# Altium schematic sheet InertiaScreen_CurriculumDesign.SchDoc
size 177 x 152 mm; SheetNumber: 1; SheetTotal: 1
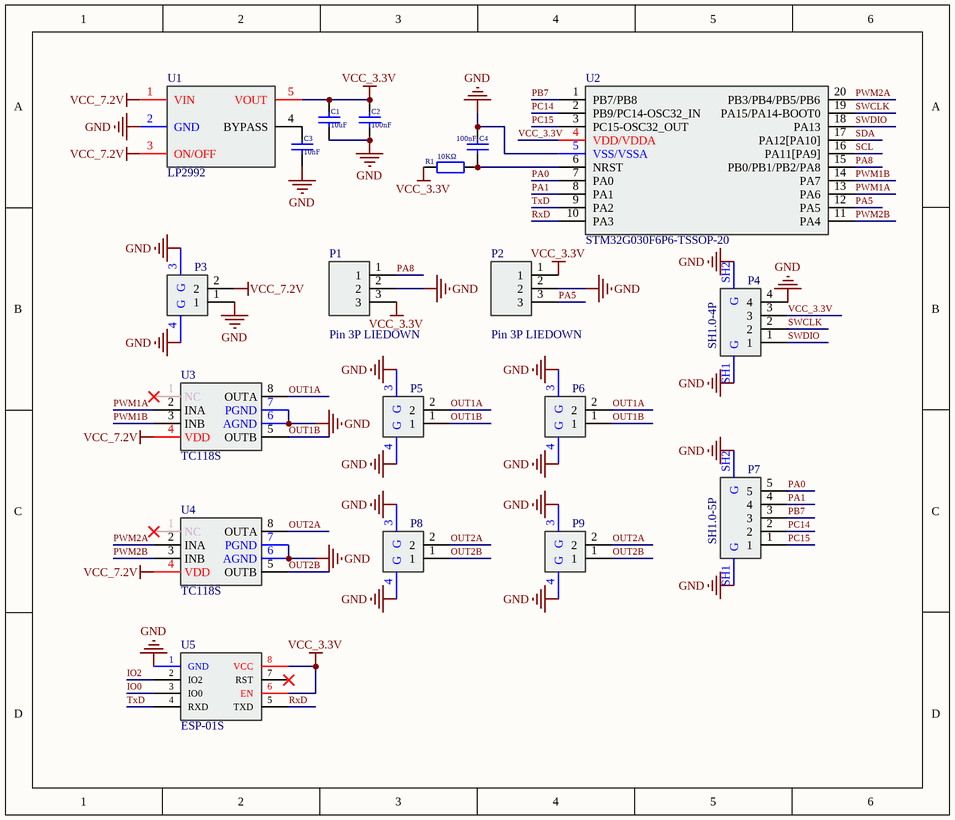
[diagram p0: InertiaScreen_CurriculumDesign.SchDoc]

## Parts
C1  10uF  [0402_C]
C2  100nF  [0402_C]
C3  10nF  [0402_C]
C4  100nF  [0402_C]
P1  Pin 3P LIEDOWN  [Pin 3P LieDown]
P2  Pin 3P LIEDOWN  [Pin 3P LieDown]
P3  SH1.00mm 2P  [SH1.0-2P]  (value not drawn)
P4  SH1.0-4P  [SH1.0-4P]
P5  SH1.00mm 2P  [SH1.0-2P]  (value not drawn)
P6  SH1.00mm 2P  [SH1.0-2P]  (value not drawn)
P7  SH1.0-5P  [SH1.0-5P]
P8  SH1.00mm 2P  [SH1.0-2P]  (value not drawn)
P9  SH1.00mm 2P  [SH1.0-2P]  (value not drawn)
R1  10KΩ  [0402_R]
U1  LP2992  [SOT23-5]
U2  STM32G030F6P6-TSSOP-20  [TSSOP-20]
U3  TC118S  [SOP-8]
U4  TC118S  [SOP-8]
U5  ESP-01S  [ESP-01S-NoSlik]

## Nets
GND: C1.1 C2.1 C3.1 C4.2 P1.2 P2.2 P3.1 P3.3(G) P3.4(G) P4.4 P4.SH1(G) P4.SH2(G) P5.3(G) P5.4(G) P6.3(G) P6.4(G) P7.SH1(G) P7.SH2(G) P8.3(G) P8.4(G) P9.3(G) P9.4(G) U1.2(GND) U2.5(VSS/VSSA) U3.6(AGND) U3.7(PGND) U4.6(AGND) U4.7(PGND) U5.1(GND)
VCC_3.3V: C1.2 C2.2 P1.3 P2.1 P4.3 R1.1 U1.5(VOUT) U2.4(VDD/VDDA) U5.6(EN) U5.8(VCC)
VCC_7.2V: P3.2 U1.1(VIN) U1.3(ON/OFF) U3.4(VDD) U4.4(VDD)
IO0: U5.3(IO0)
IO2: U5.2(IO2)
OUT1A: P5.2 P6.2 U3.8(OUTA)
OUT1B: P5.1 P6.1 U3.5(OUTB)
OUT2A: P8.2 P9.2 U4.8(OUTA)
OUT2B: P8.1 P9.1 U4.5(OUTB)
PA0: P7.5 U2.7(PA0)
PA1: P7.4 U2.8(PA1)
PA5: P2.3 U2.12(PA5)
PA8: P1.1 U2.15(PB0/PB1/PB2/PA8)
PB7: P7.3 U2.1(PB7/PB8)
PC14: P7.2 U2.2(PB9/PC14-OSC32_IN)
PC15: P7.1 U2.3(PC15-OSC32_OUT)
PWM1A: U2.13(PA6) U3.2(INA)
PWM1B: U2.14(PA7) U3.3(INB)
PWM2A: U2.20(PB3/PB4/PB5/PB6) U4.2(INA)
PWM2B: U2.11(PA4) U4.3(INB)
RxD: U2.10(PA3) U5.5(TXD)
SCL: U2.16(PA11[PA9])
SDA: U2.17(PA12[PA10])
SWCLK: P4.2 U2.19(PA15/PA14-BOOT0)
SWDIO: P4.1 U2.18(PA13)
TxD: U2.9(PA2) U5.4(RXD)
NetC3_2: C3.2 U1.4(BYPASS)
NetC4_1: C4.1 R1.2 U2.6(NRST)

Not connected (* = marked no-connect by the designer): U3 1(NC)*; U4 1(NC)*; U5 7(RST)*

## Library data of the parts
C1 = 0402 10uF (106) 20% 6.3V: 贴片电容; ComponentLink1Description: 供应商链接; ComponentLink1URL: http://www.szlcsc.com/product/details_16204.html; Package: 0402; Supplier: LC; SuppliersPartNumber: C15525
C2 C4 = 0402 100nF (104) 10% 16V: 贴片电容; ComponentLink1Description: 供应商链接; ComponentLink1URL: http://www.szlcsc.com/product/details_1877.html; Package: 0402; Supplier: LC; SuppliersPartNumber: C1525
C3 = 0402 10nF (103) 10% 50V: 贴片电容; ComponentLink1Description: 供应商链接; ComponentLink1URL: http://www.szlcsc.com/product/details_15869.html; Package: 0402; Supplier: LC; SuppliersPartNumber: C15195
P1 P2 = Pin 3P LIEDOWN: 排针卧贴 3P
P3 P5 P6 P8 P9 = SH1.00mm 2P: SH1.00mm 2P 卧贴
P4 = SH1.0-4P: SH1.00mm 4P 卧贴
P7 = SH1.0-5P: SH1.00mm 5P 卧贴
R1 = 0402 10KΩ (1002) 1%: 贴片电阻; ComponentLink1Description: 供应商链接; ComponentLink1URL: http://www.szlcsc.com/product/details_26487.html; Package: 0402; Supplier: LC; SuppliersPartNumber: C25744
U1 = LP2992: LDO 5.x-3.3V
U3 U4 = TC118S: TC118S FM单路直流电机驱动
U5 = ESP-01S: ESP01S开发板